# EasyEDA schematic EasyEDA_JamSoft SI-1_2021-01-22.json
TITLE: SI-1; REV: 1.0; Date: 2020-10-22; Sheet: 1/1; Drawn By: Chris Jamieson; Company: JamSoft
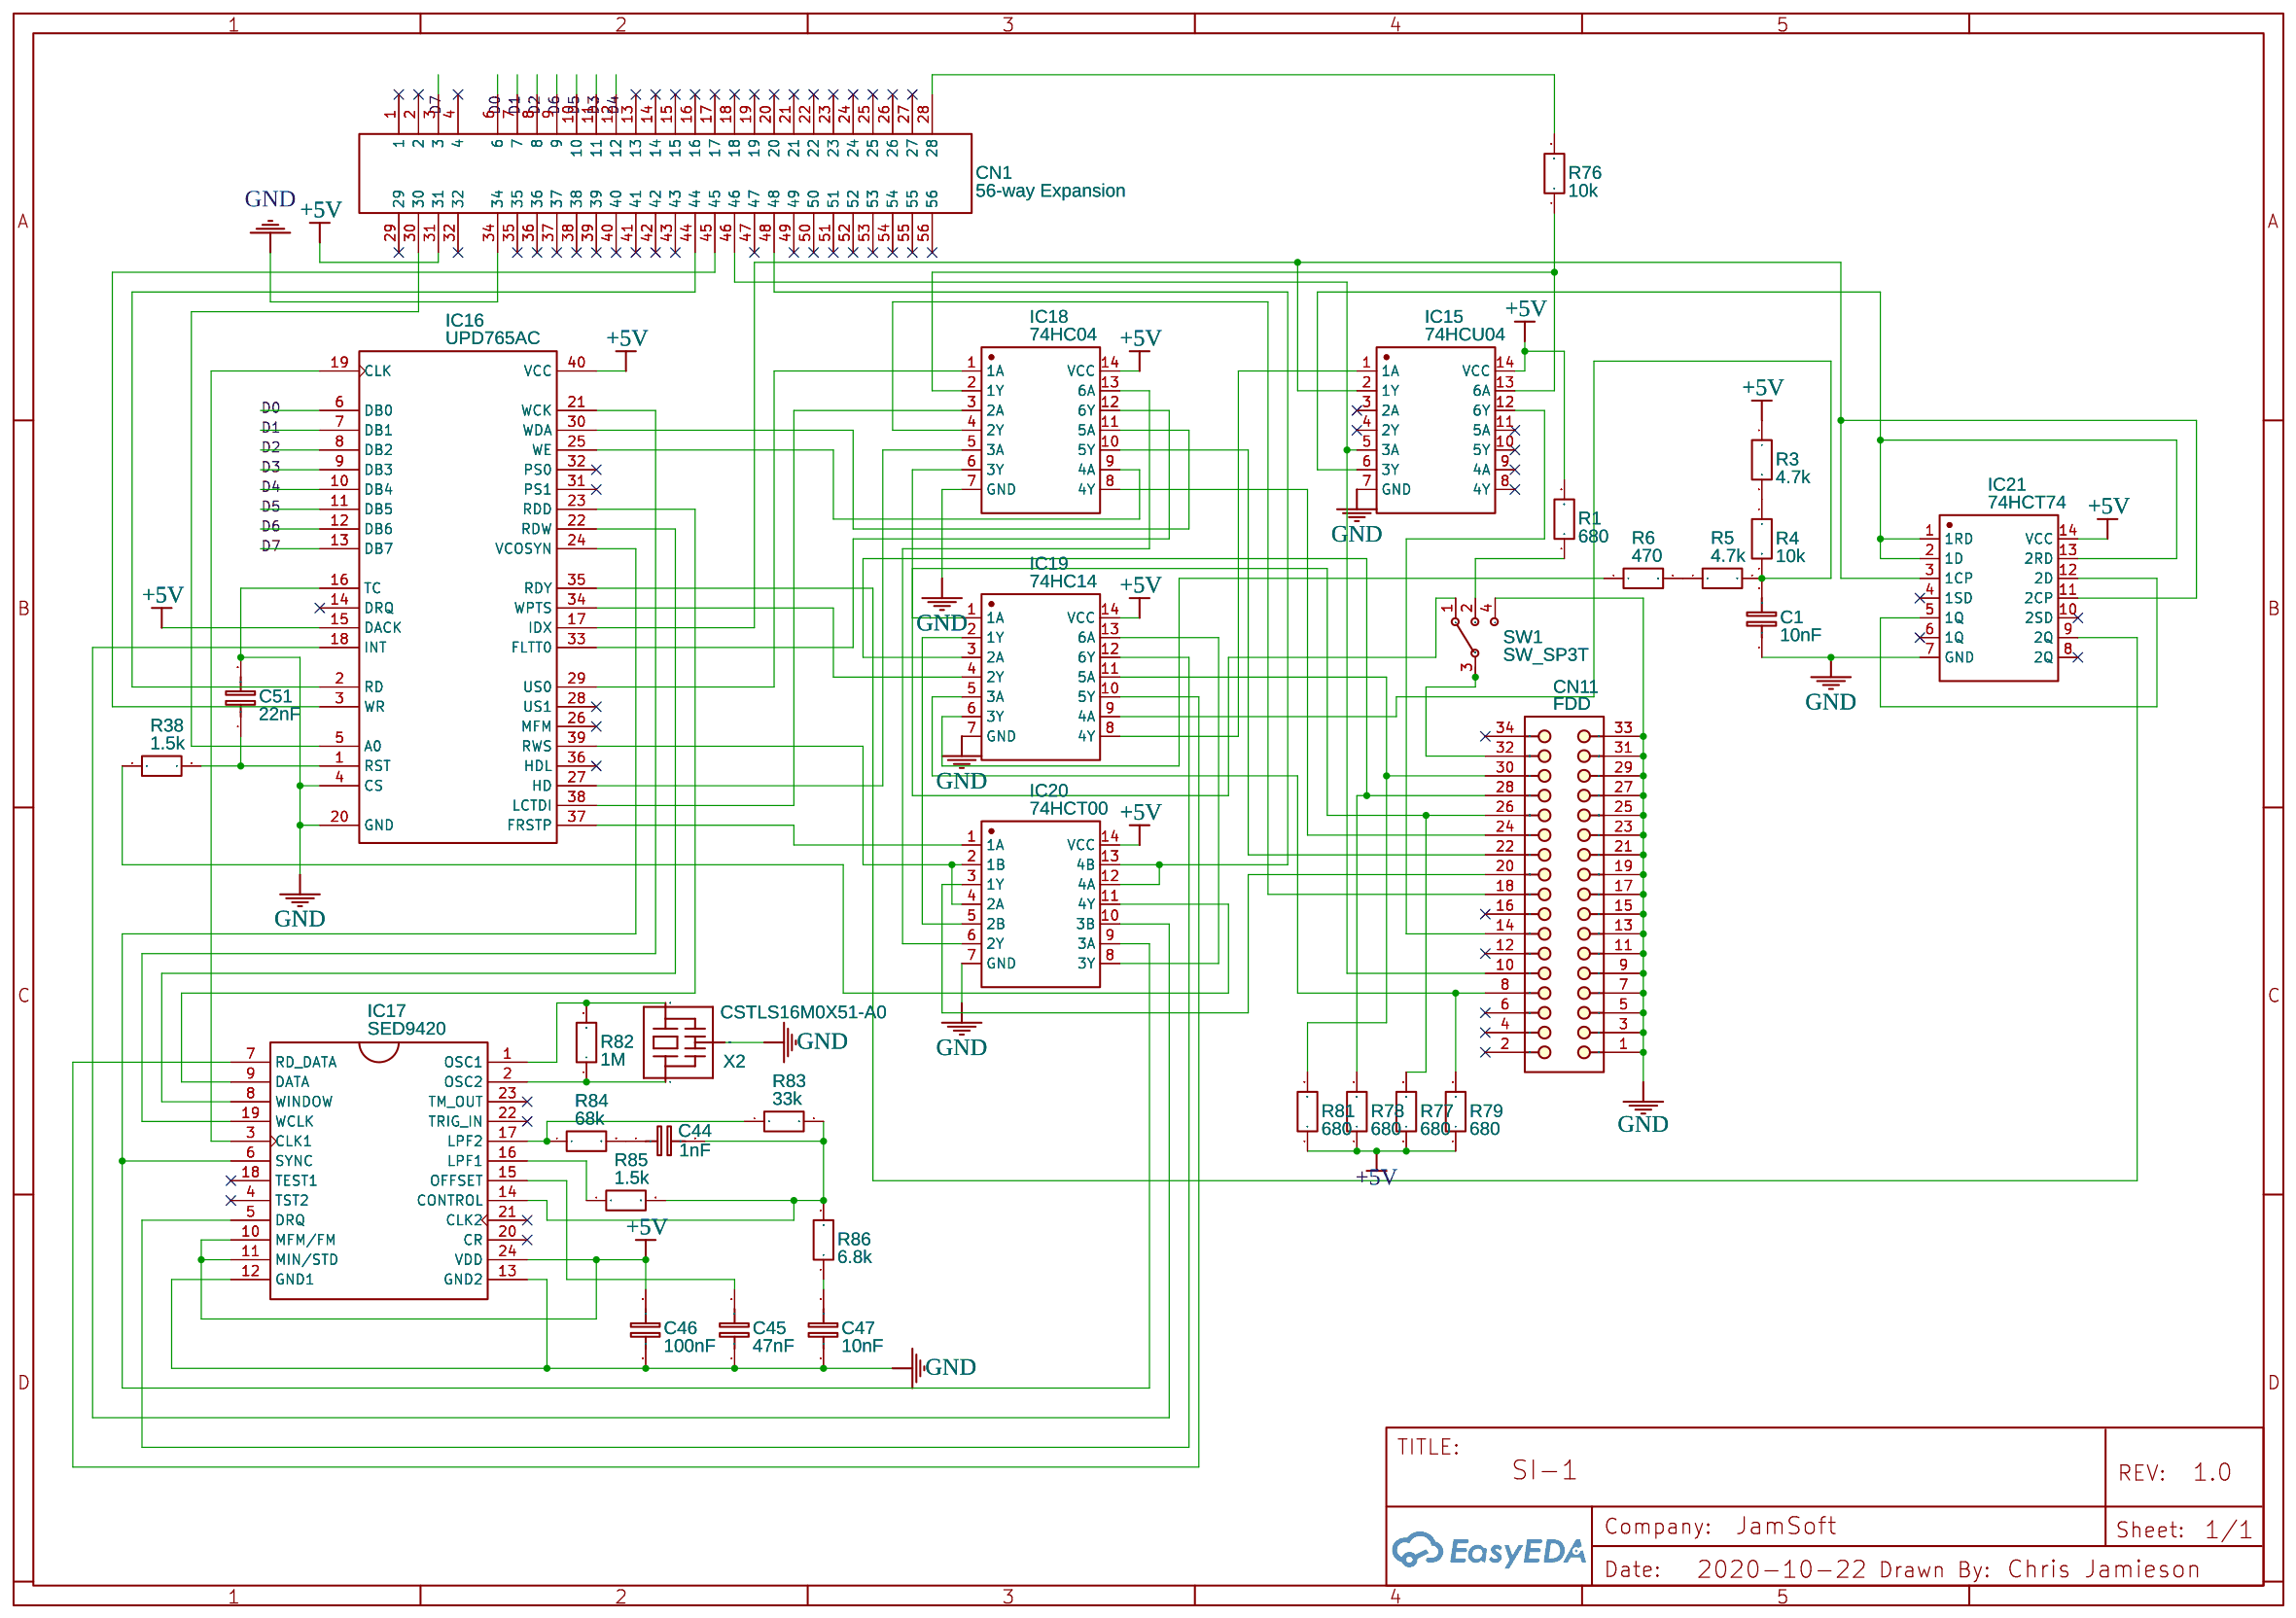
[diagram p0: schematic sheet]

## Parts
C1  10nF  [RAD-0.1]
C44  1nF  [RAD-0.2]
C45  47nF  [RAD-0.2]
C46  100nF  [RAD-0.2]
C47  10nF  [RAD-0.1]
C51  22nF  [RAD-0.2]
CN1  56-way Expansion  [56 WAY EDGE CONNECTOR 2]
CN11  FDD  [918534X914]
IC15  74HCU04  [DIP14]
IC16  UPD765AC  [DIP40]
IC17  SED9420  [DIP-24__600]
IC18  74HC04  [DIP14]
IC19  74HC14  [DIP14]
IC20  74HCT00  [DIP14]
IC21  74HCT74  [DIP14]
R1  680  [R_AXIAL-0.4]
R3  4.7k  [R_AXIAL-0.4]
R4  10k  [R_AXIAL-0.4]
R5  4.7k  [R_AXIAL-0.4]
R6  470  [R_AXIAL-0.4]
R38  1.5k  [R_AXIAL-0.4]
R76  10k  [R_AXIAL-0.4]
R77  680  [R_AXIAL-0.4]
R78  680  [R_AXIAL-0.4]
R79  680  [R_AXIAL-0.4]
R81  680  [R_AXIAL-0.4]
R82  1M  [R_AXIAL-0.4]
R83  33k  [R_AXIAL-0.4]
R84  68k  [R_AXIAL-0.4]
R85  1.5k  [R_AXIAL-0.4]
R86  6.8k  [R_AXIAL-0.4]
SW1  SW_SP3T  [MHS131 SP3T]
X2  CSTLS16M0X51-A0  [CSTLS_X]

## Library data of the parts
C1 C44-C47 C51 = C_RAD-0.2_EU: Contributor: LCEDA_Lib
CN1 = 56-way PCB Connector: Contributor: chrisjam82
CN11 = 09 18 534 6914: Flat Cable Connector (IDC), Standard Male Header, Straight Solder Pin, 34 Contacts, Short Levers, Performance Level 2
IC15 IC18 = 74HC04N,652
IC16 = UPD765AC: SingleDouble Density Floppy Disk Controller
IC17 = SED9420: Manufacturer: Epson; Manufacturer Part: SED9420CAC; Contributor: chrisjam82
IC19 = 74HC14N,652
IC20 = 74HCT00N
IC21 = 74HCT74N
R1 R3-R6 R38 R76-R79 R81 R83-R86 = R_AXIAL-0.4_EU: Contributor: LCEDA_Lib
R82 = R_AXIAL-0.6_EU: Contributor: LCEDA_Lib
SW1 = SW_SP3T: Contributor: KiCAD; license: https://www.gnu.org/licenses/lgpl-2.1.html
X2 = CSTLS_X

## Nets
+5V: C46.2 CN1.31 IC15.14(VCC) IC16.15(DACK) IC16.40(VCC) IC17.10(MFM/FM) IC17.11(MIN/STD) IC17.24(VDD) IC18.14(VCC) IC19.14(VCC) IC20.14(VCC) IC21.14(VCC) R1.2 R3.1 R77.1 R78.1 R79.1 R81.1
GND: C1.1 C45.1 C46.1 C47.1 C51.2 CN1.34 CN11.1 CN11.3 CN11.5 CN11.7 CN11.9 CN11.11 CN11.13 CN11.15 CN11.17 CN11.19 CN11.21 CN11.23 CN11.25 CN11.27 CN11.29 CN11.31 CN11.33 IC15.7(GND) IC16.4(CS) IC16.16(TC) IC16.20(GND) IC17.12(GND1) IC17.13(GND2) IC18.7(GND) IC19.7(GND) IC20.7(GND) IC21.7(GND) SW1.4 X2.2(VSS)
D0: CN1.6 IC16.6(DB0)
D1: CN1.7 IC16.7(DB1)
D2: CN1.8 IC16.8(DB2)
D3: CN1.11 IC16.9(DB3)
D4: CN1.12 IC16.10(DB4)
D5: CN1.10 IC16.11(DB5)
D6: CN1.9 IC16.12(DB6)
D7: CN1.3 IC16.13(DB7)
Net-(C1-2): C1.2 IC19.9(4A) R4.2 R5.2
Net-(C44-1): C44.1 R84.2
Net-(C44-2): C44.2 IC17.14(CONTROL) R83.2 R85.2 R86.2
Net-(C45-2): C45.2 IC17.15(OFFSET)
Net-(C47-2): C47.2 R86.1
Net-(C51-1): C51.1 IC16.1(RST) R38.2
Net-(CN1-28): CN1.28 R76.2
Net-(CN1-30): CN1.30 IC16.5(A0)
Net-(CN1-44): CN1.44 IC16.2(RD)
Net-(CN1-45): CN1.45 IC16.3(WR)
Net-(CN1-46): CN1.46 CN11.10 IC15.5(3A)
Net-(CN1-48): CN1.48 IC20.12(4A) IC20.13(4B)
Net-(CN11-8): CN11.8 IC19.5(3A) R79.2
Net-(CN11-14): CN11.14 IC15.12(6Y)
Net-(CN11-18): CN11.18 IC18.4(2Y)
Net-(CN11-20): CN11.20 IC20.3(1Y)
Net-(CN11-22): CN11.22 IC18.10(5Y)
Net-(CN11-24): CN11.24 IC18.8(4Y)
Net-(CN11-26): CN11.26 IC19.1(1A) R77.2
Net-(CN11-28): CN11.28 IC19.3(2A) R78.2
Net-(CN11-30): CN11.30 IC19.11(5A) R81.2
Net-(CN11-32): CN11.32 SW1.3
Net-(IC15-1): IC15.1(1A) IC19.8(4Y)
Net-(IC15-2): IC15.2(1Y) IC16.17(IDX) IC21.3(1CP) IC21.11(2CP)
Net-(IC15-6): IC15.6(3Y) IC21.1(1RD) IC21.2(1D) IC21.13(2RD)
Net-(IC15-13): IC15.13(6A) IC18.2(1Y) R76.1
Net-(IC16-18): IC16.18(INT) IC20.10(3B)
Net-(IC16-19): IC16.19(CLK) IC17.3(CLK1)
Net-(IC16-21): IC16.21(WCK) IC17.19(WCLK)
Net-(IC16-22): IC16.22(RDW) IC17.8(WINDOW)
Net-(IC16-23): IC16.23(RDD) IC17.9(DATA)
Net-(IC16-24): IC16.24(VCOSYN) IC17.6(SYNC) IC20.9(3A)
Net-(IC16-25): IC16.25(WE) IC18.9(4A)
Net-(IC16-27): IC16.27(HD) IC18.5(3A)
Net-(IC16-29): IC16.29(US0) IC18.1(1A)
Net-(IC16-30): IC16.30(WDA) IC18.11(5A)
Net-(IC16-33): IC16.33(FLTT0) IC18.12(6Y)
Net-(IC16-34): IC16.34(WPTS) IC19.4(2Y)
Net-(IC16-35): IC16.35(RDY) IC21.9(2Q)
Net-(IC16-37): IC16.37(FRSTP) IC20.1(1A)
Net-(IC16-38): IC16.38(LCTDI) IC18.3(2A)
Net-(IC16-39): IC16.39(RWS) IC20.2(1B) IC20.4(2A)
Net-(IC17-1): IC17.1(OSC1) R82.2 X2.3
Net-(IC17-2): IC17.2(OSC2) R82.1 X2.1
Net-(IC17-5): IC17.5(DRQ) IC19.12(6Y)
Net-(IC17-7): IC17.7(RD DATA) IC19.10(5Y)
Net-(IC17-16): IC17.16(LPF1) R85.1
Net-(IC17-17): IC17.17(LPF2) R83.1 R84.1
Net-(IC18-6): IC18.6(3Y) SW1.1
Net-(IC18-13): IC18.13(6A) IC20.6(2Y)
Net-(IC19-2): IC19.2(1Y) IC20.5(2B)
Net-(IC19-6): IC19.6(3Y) R6.1
Net-(IC19-13): IC19.13(6A) IC20.8(3Y)
Net-(IC20-11): IC20.11(4Y) R38.1
Net-(IC21-5): IC21.5(1Q) IC21.12(2D)
Net-(R1-1): R1.1 SW1.2
Net-(R3-2): R3.2 R4.1
Net-(R5-1): R5.1 R6.2

Not connected (* = marked no-connect by the designer): CN1 1* 2* 4* 13* 14* 15* 16* 17* 18* 19* 20* 21* 22* 23* 24* 25* 26* 27* 29* 32* 35* 36* 37* 38* 39* 40* 41* 42* 43* 47* 49* 50* 51* 52* 53* 54* 55* 56*; CN11 2* 4* 6* 12* 16* 34*; IC15 3(2A)* 4(2Y)* 8(4Y)* 9(4A)* 10(5Y)* 11(5A)*; IC16 14(DRQ)* 26(MFM)* 28(US1)* 31(PS1)* 32(PS0)* 36(HDL)*; IC17 4(TST2)* 18(TEST1)* 20(CR)* 21(CLK2)* 22(TRIG IN)* 23(TM OUT)*; IC21 4(1SD)* 6(1Q)* 8(2Q)* 10(2SD)*
